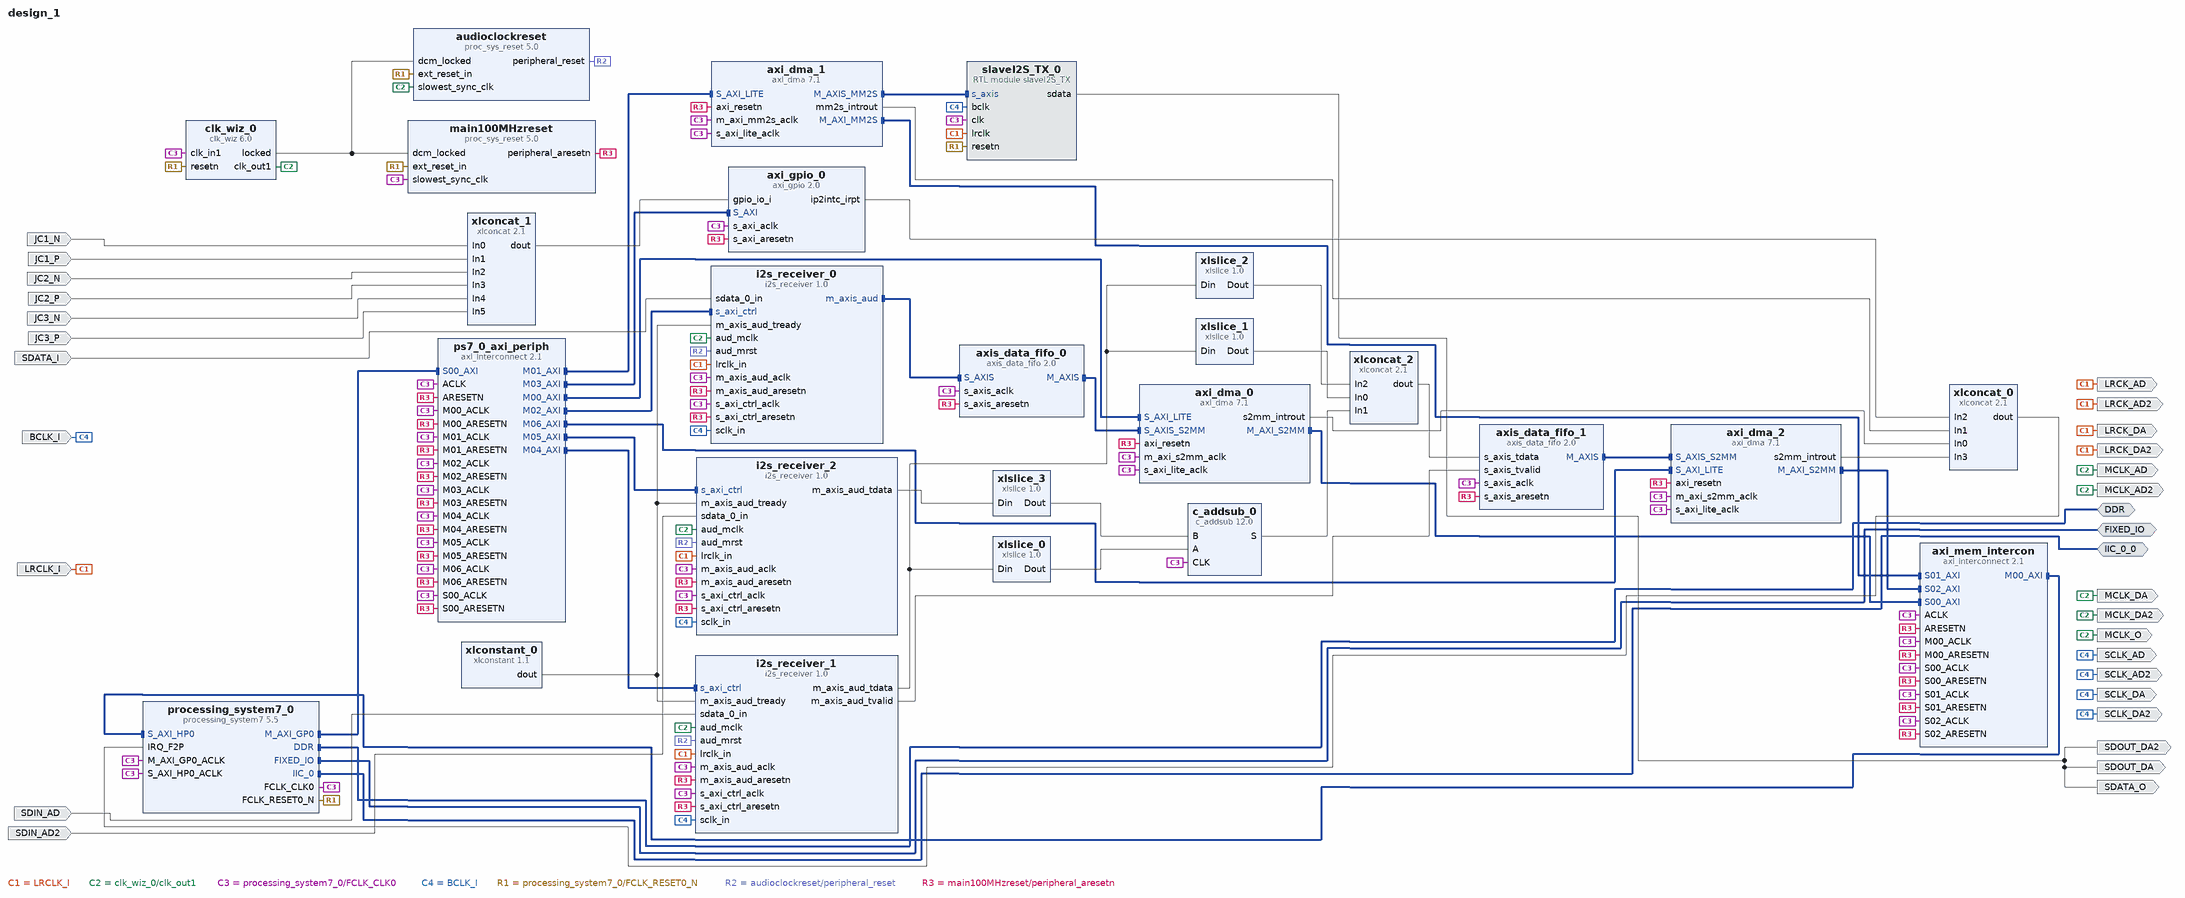
[diagram p0: block diagram of the top level]
# Vivado block design design_1, xc7z020clg484-1, Vivado 2020.1
create_bd_design design_1

create_bd_intf_port -mode Master -vlnv xilinx.com:interface:ddrx_rtl:1.0 DDR
create_bd_intf_port -mode Master -vlnv xilinx.com:display_processing_system7:fixedio_rtl:1.0 FIXED_IO
create_bd_intf_port -mode Master -vlnv xilinx.com:interface:iic_rtl:1.0 IIC_0_0
create_bd_port -dir O SDATA_O
create_bd_port -dir I SDATA_I
create_bd_port -dir I BCLK_I
create_bd_port -dir I LRCLK_I
create_bd_port -dir O MCLK_O
create_bd_port -dir I JC1_N
create_bd_port -dir I JC1_P
create_bd_port -dir I JC3_P
create_bd_port -dir I JC3_N
create_bd_port -dir I JC2_P
create_bd_port -dir I JC2_N
create_bd_port -dir O MCLK_DA
create_bd_port -dir O MCLK_AD
create_bd_port -dir O MCLK_DA2
create_bd_port -dir O MCLK_AD2
create_bd_port -dir O LRCK_DA
create_bd_port -dir O LRCK_DA2
create_bd_port -dir O SCLK_DA
create_bd_port -dir O SCLK_DA2
create_bd_port -dir I SDIN_AD
create_bd_port -dir I SDIN_AD2
create_bd_port -dir O SDOUT_DA
create_bd_port -dir O SDOUT_DA2
create_bd_port -dir O SCLK_AD
create_bd_port -dir O SCLK_AD2
create_bd_port -dir O LRCK_AD
create_bd_port -dir O LRCK_AD2

create_bd_cell -type ip -vlnv xilinx.com:ip:i2s_receiver:1.0 i2s_receiver_0
set_property -dict {CONFIG.C_32BIT_LR 1 CONFIG.C_DEPTH 1024 CONFIG.C_IS_MASTER 0} [get_bd_cells i2s_receiver_0]
create_bd_cell -type ip -vlnv xilinx.com:ip:processing_system7:5.5 processing_system7_0
set_property -dict [list \
  CONFIG.PCW_APU_PERIPHERAL_FREQMHZ 666.666667 \
  CONFIG.PCW_ENET0_ENET0_IO {MIO 16 .. 27} \
  CONFIG.PCW_ENET0_GRP_MDIO_ENABLE 1 \
  CONFIG.PCW_ENET0_GRP_MDIO_IO {MIO 52 .. 53} \
  CONFIG.PCW_ENET0_PERIPHERAL_ENABLE 1 \
  CONFIG.PCW_ENET0_RESET_ENABLE 0 \
  CONFIG.PCW_ENET_RESET_ENABLE 1 \
  CONFIG.PCW_ENET_RESET_SELECT {Share reset pin} \
  CONFIG.PCW_FPGA0_PERIPHERAL_FREQMHZ 100 \
  CONFIG.PCW_FPGA1_PERIPHERAL_FREQMHZ 150.000000 \
  CONFIG.PCW_GPIO_MIO_GPIO_ENABLE 1 \
  CONFIG.PCW_GPIO_MIO_GPIO_IO MIO \
  CONFIG.PCW_I2C0_I2C0_IO EMIO \
  CONFIG.PCW_I2C0_PERIPHERAL_ENABLE 1 \
  CONFIG.PCW_I2C_PERIPHERAL_FREQMHZ 111.111115 \
  CONFIG.PCW_I2C_RESET_ENABLE 1 \
  CONFIG.PCW_I2C_RESET_SELECT {Share reset pin} \
  CONFIG.PCW_IRQ_F2P_INTR 1 \
  CONFIG.PCW_PRESET_BANK1_VOLTAGE {LVCMOS 1.8V} \
  CONFIG.PCW_QSPI_GRP_SINGLE_SS_ENABLE 1 \
  CONFIG.PCW_QSPI_GRP_SINGLE_SS_IO {MIO 1 .. 6} \
  CONFIG.PCW_QSPI_PERIPHERAL_ENABLE 1 \
  CONFIG.PCW_QSPI_QSPI_IO {MIO 1 .. 6} \
  CONFIG.PCW_SD0_GRP_CD_ENABLE 1 \
  CONFIG.PCW_SD0_GRP_CD_IO {MIO 47} \
  CONFIG.PCW_SD0_GRP_WP_ENABLE 1 \
  CONFIG.PCW_SD0_GRP_WP_IO {MIO 46} \
  CONFIG.PCW_SD0_PERIPHERAL_ENABLE 1 \
  CONFIG.PCW_SD0_SD0_IO {MIO 40 .. 45} \
  CONFIG.PCW_SDIO_PERIPHERAL_FREQMHZ 50 \
  CONFIG.PCW_SINGLE_QSPI_DATA_MODE x4 \
  CONFIG.PCW_TTC0_PERIPHERAL_ENABLE 1 \
  CONFIG.PCW_TTC0_TTC0_IO EMIO \
  CONFIG.PCW_UART1_PERIPHERAL_ENABLE 1 \
  CONFIG.PCW_UART1_UART1_IO {MIO 48 .. 49} \
  CONFIG.PCW_UART_PERIPHERAL_FREQMHZ 50 \
  CONFIG.PCW_UIPARAM_DDR_FREQ_MHZ 533.333313 \
  CONFIG.PCW_UIPARAM_DDR_PARTNO {MT41J128M16 HA-15E} \
  CONFIG.PCW_USB0_PERIPHERAL_ENABLE 1 \
  CONFIG.PCW_USB0_RESET_ENABLE 0 \
  CONFIG.PCW_USB0_USB0_IO {MIO 28 .. 39} \
  CONFIG.PCW_USB_RESET_ENABLE 1 \
  CONFIG.PCW_USB_RESET_SELECT {Share reset pin} \
  CONFIG.PCW_USE_FABRIC_INTERRUPT 1 \
  CONFIG.PCW_USE_S_AXI_HP0 1 \
  CONFIG.preset ZedBoard \
] [get_bd_cells processing_system7_0]
# 225 more settings of processing_system7_0 are not shown: defaults, MIO pin electricals, DDR timing, and values the tool derives
create_bd_cell -type ip -vlnv xilinx.com:ip:clk_wiz:6.0 clk_wiz_0
set_property -dict [list \
  CONFIG.CLKOUT1_JITTER 360.948 \
  CONFIG.CLKOUT1_PHASE_ERROR 301.601 \
  CONFIG.CLKOUT1_REQUESTED_OUT_FREQ 12.288 \
  CONFIG.MMCM_CLKFBOUT_MULT_F 48.000 \
  CONFIG.MMCM_CLKOUT0_DIVIDE_F 78.125 \
  CONFIG.MMCM_DIVCLK_DIVIDE 5 \
  CONFIG.RESET_PORT resetn \
  CONFIG.RESET_TYPE ACTIVE_LOW \
  CONFIG.USE_RESET true \
] [get_bd_cells clk_wiz_0]
create_bd_cell -type ip -vlnv xilinx.com:ip:proc_sys_reset:5.0 main100MHzreset
create_bd_cell -type ip -vlnv xilinx.com:ip:proc_sys_reset:5.0 audioclockreset
create_bd_cell -type ip -vlnv xilinx.com:ip:axi_dma:7.1 axi_dma_0
set_property -dict [list \
  CONFIG.c_include_mm2s 0 \
  CONFIG.c_include_s2mm_dre 1 \
  CONFIG.c_include_sg 0 \
  CONFIG.c_s2mm_burst_size 32 \
  CONFIG.c_sg_length_width 26 \
] [get_bd_cells axi_dma_0]
create_bd_cell -type ip -vlnv xilinx.com:ip:axi_dma:7.1 axi_dma_1
set_property -dict [list \
  CONFIG.c_include_mm2s_dre 0 \
  CONFIG.c_include_s2mm 0 \
  CONFIG.c_include_sg 0 \
  CONFIG.c_mm2s_burst_size 32 \
  CONFIG.c_sg_length_width 26 \
] [get_bd_cells axi_dma_1]
create_bd_cell -type ip -vlnv xilinx.com:ip:axis_data_fifo:2.0 axis_data_fifo_0
set_property -dict {CONFIG.FIFO_DEPTH 8192 CONFIG.FIFO_MEMORY_TYPE block CONFIG.HAS_TLAST 1} [get_bd_cells axis_data_fifo_0]
create_bd_cell -type ip -vlnv xilinx.com:ip:axi_interconnect:2.1 ps7_0_axi_periph
set_property -dict {CONFIG.NUM_MI 7} [get_bd_cells ps7_0_axi_periph]
create_bd_cell -type ip -vlnv xilinx.com:ip:axi_interconnect:2.1 axi_mem_intercon
set_property -dict {CONFIG.NUM_MI 1 CONFIG.NUM_SI 3} [get_bd_cells axi_mem_intercon]
create_bd_cell -type ip -vlnv xilinx.com:ip:xlconcat:2.1 xlconcat_0
set_property -dict {CONFIG.NUM_PORTS 4} [get_bd_cells xlconcat_0]
create_bd_cell -type ip -vlnv xilinx.com:ip:xlconstant:1.1 xlconstant_0
create_bd_cell -type ip -vlnv xilinx.com:ip:xlconcat:2.1 xlconcat_1
set_property -dict {CONFIG.NUM_PORTS 6} [get_bd_cells xlconcat_1]
create_bd_cell -type ip -vlnv xilinx.com:ip:axi_gpio:2.0 axi_gpio_0
set_property -dict {CONFIG.C_ALL_INPUTS 1 CONFIG.C_GPIO_WIDTH 6 CONFIG.C_INTERRUPT_PRESENT 1} [get_bd_cells axi_gpio_0]
create_bd_cell -type ip -vlnv xilinx.com:ip:i2s_receiver:1.0 i2s_receiver_1
set_property -dict {CONFIG.C_32BIT_LR 1 CONFIG.C_DEPTH 1024 CONFIG.C_IS_MASTER 0} [get_bd_cells i2s_receiver_1]
create_bd_cell -type ip -vlnv xilinx.com:ip:i2s_receiver:1.0 i2s_receiver_2
set_property -dict {CONFIG.C_32BIT_LR 1 CONFIG.C_DEPTH 1024 CONFIG.C_IS_MASTER 0} [get_bd_cells i2s_receiver_2]
create_bd_cell -type ip -vlnv xilinx.com:ip:axis_data_fifo:2.0 axis_data_fifo_1
set_property -dict {CONFIG.FIFO_DEPTH 4096 CONFIG.TDATA_NUM_BYTES 4} [get_bd_cells axis_data_fifo_1]
create_bd_cell -type ip -vlnv xilinx.com:ip:c_addsub:12.0 c_addsub_0
set_property -dict [list \
  CONFIG.A_Width 23 \
  CONFIG.B_Value 00000000000000000000000 \
  CONFIG.B_Width 23 \
  CONFIG.CE false \
  CONFIG.C_In false \
  CONFIG.Implementation DSP48 \
  CONFIG.Latency 2 \
  CONFIG.Latency_Configuration Automatic \
  CONFIG.Out_Width 24 \
] [get_bd_cells c_addsub_0]
create_bd_cell -type ip -vlnv xilinx.com:ip:xlslice:1.0 xlslice_0
set_property -dict {CONFIG.DIN_FROM 27 CONFIG.DIN_TO 5 CONFIG.DOUT_WIDTH 23} [get_bd_cells xlslice_0]
create_bd_cell -type ip -vlnv xilinx.com:ip:xlslice:1.0 xlslice_1
set_property -dict {CONFIG.DIN_FROM 31 CONFIG.DIN_TO 28 CONFIG.DOUT_WIDTH 4} [get_bd_cells xlslice_1]
create_bd_cell -type ip -vlnv xilinx.com:ip:xlslice:1.0 xlslice_2
set_property -dict {CONFIG.DIN_FROM 3 CONFIG.DIN_TO 1 CONFIG.DOUT_WIDTH 3} [get_bd_cells xlslice_2]
create_bd_cell -type ip -vlnv xilinx.com:ip:xlslice:1.0 xlslice_3
set_property -dict {CONFIG.DIN_FROM 27 CONFIG.DIN_TO 5 CONFIG.DOUT_WIDTH 23} [get_bd_cells xlslice_3]
create_bd_cell -type ip -vlnv xilinx.com:ip:xlconcat:2.1 xlconcat_2
set_property -dict {CONFIG.IN0_WIDTH 4 CONFIG.IN1_WIDTH 24 CONFIG.IN2_WIDTH 4 CONFIG.NUM_PORTS 3} [get_bd_cells xlconcat_2]
create_bd_cell -type ip -vlnv xilinx.com:ip:axi_dma:7.1 axi_dma_2
set_property -dict [list \
  CONFIG.c_include_mm2s 0 \
  CONFIG.c_include_s2mm_dre 1 \
  CONFIG.c_include_sg 0 \
  CONFIG.c_sg_length_width 26 \
] [get_bd_cells axi_dma_2]
create_bd_cell -type module -reference slaveI2S_TX slaveI2S_TX_0

# ---- connections ----

connect_bd_intf_net [get_bd_intf_pins ps7_0_axi_periph/M02_AXI] [get_bd_intf_pins i2s_receiver_0/s_axi_ctrl]
connect_bd_intf_net [get_bd_intf_pins ps7_0_axi_periph/M05_AXI] [get_bd_intf_pins i2s_receiver_2/s_axi_ctrl]
connect_bd_intf_net [get_bd_intf_pins slaveI2S_TX_0/s_axis] [get_bd_intf_pins axi_dma_1/M_AXIS_MM2S]
connect_bd_intf_net [get_bd_intf_pins processing_system7_0/M_AXI_GP0] [get_bd_intf_pins ps7_0_axi_periph/S00_AXI]
connect_bd_intf_net [get_bd_intf_ports DDR] [get_bd_intf_pins processing_system7_0/DDR]
connect_bd_intf_net [get_bd_intf_pins axis_data_fifo_0/M_AXIS] [get_bd_intf_pins axi_dma_0/S_AXIS_S2MM]
connect_bd_intf_net [get_bd_intf_ports FIXED_IO] [get_bd_intf_pins processing_system7_0/FIXED_IO]
connect_bd_intf_net [get_bd_intf_pins axi_dma_1/M_AXI_MM2S] [get_bd_intf_pins axi_mem_intercon/S01_AXI]
connect_bd_intf_net [get_bd_intf_ports IIC_0_0] [get_bd_intf_pins processing_system7_0/IIC_0]
connect_bd_intf_net [get_bd_intf_pins ps7_0_axi_periph/M03_AXI] [get_bd_intf_pins axi_gpio_0/S_AXI]
connect_bd_intf_net [get_bd_intf_pins ps7_0_axi_periph/M04_AXI] [get_bd_intf_pins i2s_receiver_1/s_axi_ctrl]
connect_bd_intf_net [get_bd_intf_pins ps7_0_axi_periph/M01_AXI] [get_bd_intf_pins axi_dma_1/S_AXI_LITE]
connect_bd_intf_net [get_bd_intf_pins axi_dma_0/M_AXI_S2MM] [get_bd_intf_pins axi_mem_intercon/S00_AXI]
connect_bd_intf_net [get_bd_intf_pins axi_dma_2/M_AXI_S2MM] [get_bd_intf_pins axi_mem_intercon/S02_AXI]
connect_bd_intf_net [get_bd_intf_pins axi_mem_intercon/M00_AXI] [get_bd_intf_pins processing_system7_0/S_AXI_HP0]
connect_bd_intf_net [get_bd_intf_pins axis_data_fifo_1/M_AXIS] [get_bd_intf_pins axi_dma_2/S_AXIS_S2MM]
connect_bd_intf_net [get_bd_intf_pins ps7_0_axi_periph/M00_AXI] [get_bd_intf_pins axi_dma_0/S_AXI_LITE]
connect_bd_intf_net [get_bd_intf_pins ps7_0_axi_periph/M06_AXI] [get_bd_intf_pins axi_dma_2/S_AXI_LITE]
connect_bd_intf_net [get_bd_intf_pins i2s_receiver_0/m_axis_aud] [get_bd_intf_pins axis_data_fifo_0/S_AXIS]
connect_bd_net [get_bd_ports LRCLK_I] \
  [get_bd_pins i2s_receiver_0/lrclk_in] [get_bd_ports LRCK_DA2] [get_bd_ports LRCK_DA] [get_bd_ports LRCK_AD2] \
  [get_bd_ports LRCK_AD] [get_bd_pins i2s_receiver_2/lrclk_in] [get_bd_pins i2s_receiver_1/lrclk_in] \
  [get_bd_pins slaveI2S_TX_0/lrclk]
connect_bd_net [get_bd_pins clk_wiz_0/clk_out1] \
  [get_bd_ports MCLK_O] [get_bd_pins i2s_receiver_0/aud_mclk] [get_bd_pins audioclockreset/slowest_sync_clk] \
  [get_bd_pins i2s_receiver_2/aud_mclk] [get_bd_pins i2s_receiver_1/aud_mclk] [get_bd_ports MCLK_DA] [get_bd_ports MCLK_AD] \
  [get_bd_ports MCLK_DA2] [get_bd_ports MCLK_AD2]
connect_bd_net [get_bd_pins processing_system7_0/FCLK_CLK0] \
  [get_bd_pins clk_wiz_0/clk_in1] [get_bd_pins i2s_receiver_0/m_axis_aud_aclk] [get_bd_pins i2s_receiver_0/s_axi_ctrl_aclk] \
  [get_bd_pins processing_system7_0/M_AXI_GP0_ACLK] [get_bd_pins main100MHzreset/slowest_sync_clk] \
  [get_bd_pins axi_dma_0/s_axi_lite_aclk] [get_bd_pins axi_dma_1/s_axi_lite_aclk] [get_bd_pins axis_data_fifo_0/s_axis_aclk] \
  [get_bd_pins axi_dma_0/m_axi_s2mm_aclk] [get_bd_pins axi_dma_1/m_axi_mm2s_aclk] \
  [get_bd_pins processing_system7_0/S_AXI_HP0_ACLK] [get_bd_pins ps7_0_axi_periph/ACLK] \
  [get_bd_pins ps7_0_axi_periph/S00_ACLK] [get_bd_pins ps7_0_axi_periph/M00_ACLK] [get_bd_pins ps7_0_axi_periph/M01_ACLK] \
  [get_bd_pins axi_mem_intercon/ACLK] [get_bd_pins axi_mem_intercon/S00_ACLK] [get_bd_pins axi_mem_intercon/M00_ACLK] \
  [get_bd_pins axi_mem_intercon/S01_ACLK] [get_bd_pins ps7_0_axi_periph/M02_ACLK] [get_bd_pins ps7_0_axi_periph/M03_ACLK] \
  [get_bd_pins axi_gpio_0/s_axi_aclk] [get_bd_pins i2s_receiver_1/s_axi_ctrl_aclk] [get_bd_pins ps7_0_axi_periph/M04_ACLK] \
  [get_bd_pins i2s_receiver_2/s_axi_ctrl_aclk] [get_bd_pins ps7_0_axi_periph/M05_ACLK] \
  [get_bd_pins i2s_receiver_1/m_axis_aud_aclk] [get_bd_pins i2s_receiver_2/m_axis_aud_aclk] \
  [get_bd_pins axis_data_fifo_1/s_axis_aclk] [get_bd_pins c_addsub_0/CLK] [get_bd_pins axi_dma_2/s_axi_lite_aclk] \
  [get_bd_pins axi_dma_2/m_axi_s2mm_aclk] [get_bd_pins axi_mem_intercon/S02_ACLK] [get_bd_pins ps7_0_axi_periph/M06_ACLK] \
  [get_bd_pins slaveI2S_TX_0/clk]
connect_bd_net [get_bd_ports SDATA_I] [get_bd_pins i2s_receiver_0/sdata_0_in]
connect_bd_net [get_bd_ports BCLK_I] \
  [get_bd_pins i2s_receiver_0/sclk_in] [get_bd_ports SCLK_AD2] [get_bd_ports SCLK_AD] [get_bd_ports SCLK_DA2] \
  [get_bd_ports SCLK_DA] [get_bd_pins i2s_receiver_2/sclk_in] [get_bd_pins i2s_receiver_1/sclk_in] \
  [get_bd_pins slaveI2S_TX_0/bclk]
connect_bd_net [get_bd_pins processing_system7_0/FCLK_RESET0_N] \
  [get_bd_pins main100MHzreset/ext_reset_in] [get_bd_pins audioclockreset/ext_reset_in] [get_bd_pins clk_wiz_0/resetn] \
  [get_bd_pins slaveI2S_TX_0/resetn]
connect_bd_net [get_bd_pins clk_wiz_0/locked] [get_bd_pins main100MHzreset/dcm_locked] [get_bd_pins audioclockreset/dcm_locked]
connect_bd_net [get_bd_pins audioclockreset/peripheral_reset] \
  [get_bd_pins i2s_receiver_0/aud_mrst] [get_bd_pins i2s_receiver_1/aud_mrst] [get_bd_pins i2s_receiver_2/aud_mrst]
connect_bd_net [get_bd_pins main100MHzreset/peripheral_aresetn] \
  [get_bd_pins i2s_receiver_0/m_axis_aud_aresetn] [get_bd_pins i2s_receiver_0/s_axi_ctrl_aresetn] \
  [get_bd_pins axi_dma_0/axi_resetn] [get_bd_pins axi_dma_1/axi_resetn] [get_bd_pins axis_data_fifo_0/s_axis_aresetn] \
  [get_bd_pins ps7_0_axi_periph/S00_ARESETN] [get_bd_pins ps7_0_axi_periph/M00_ARESETN] \
  [get_bd_pins ps7_0_axi_periph/ARESETN] [get_bd_pins ps7_0_axi_periph/M01_ARESETN] \
  [get_bd_pins axi_mem_intercon/S00_ARESETN] [get_bd_pins axi_mem_intercon/M00_ARESETN] \
  [get_bd_pins axi_mem_intercon/ARESETN] [get_bd_pins axi_mem_intercon/S01_ARESETN] \
  [get_bd_pins ps7_0_axi_periph/M02_ARESETN] [get_bd_pins ps7_0_axi_periph/M03_ARESETN] \
  [get_bd_pins axi_gpio_0/s_axi_aresetn] [get_bd_pins i2s_receiver_1/s_axi_ctrl_aresetn] \
  [get_bd_pins ps7_0_axi_periph/M04_ARESETN] [get_bd_pins i2s_receiver_2/s_axi_ctrl_aresetn] \
  [get_bd_pins ps7_0_axi_periph/M05_ARESETN] [get_bd_pins i2s_receiver_1/m_axis_aud_aresetn] \
  [get_bd_pins i2s_receiver_2/m_axis_aud_aresetn] [get_bd_pins axis_data_fifo_1/s_axis_aresetn] \
  [get_bd_pins axi_dma_2/axi_resetn] [get_bd_pins axi_mem_intercon/S02_ARESETN] [get_bd_pins ps7_0_axi_periph/M06_ARESETN]
connect_bd_net [get_bd_pins axi_dma_0/s2mm_introut] [get_bd_pins xlconcat_0/In0]
connect_bd_net [get_bd_pins axi_dma_1/mm2s_introut] [get_bd_pins xlconcat_0/In1]
connect_bd_net [get_bd_pins xlconcat_0/dout] [get_bd_pins processing_system7_0/IRQ_F2P]
connect_bd_net [get_bd_pins xlconstant_0/dout] \
  [get_bd_pins i2s_receiver_0/m_axis_aud_tready] [get_bd_pins i2s_receiver_2/m_axis_aud_tready] \
  [get_bd_pins i2s_receiver_1/m_axis_aud_tready]
connect_bd_net [get_bd_pins slaveI2S_TX_0/sdata] [get_bd_ports SDATA_O] [get_bd_ports SDOUT_DA] [get_bd_ports SDOUT_DA2]
connect_bd_net [get_bd_ports JC1_N] [get_bd_pins xlconcat_1/In0]
connect_bd_net [get_bd_ports JC1_P] [get_bd_pins xlconcat_1/In1]
connect_bd_net [get_bd_ports JC2_N] [get_bd_pins xlconcat_1/In2]
connect_bd_net [get_bd_ports JC2_P] [get_bd_pins xlconcat_1/In3]
connect_bd_net [get_bd_ports JC3_N] [get_bd_pins xlconcat_1/In4]
connect_bd_net [get_bd_ports JC3_P] [get_bd_pins xlconcat_1/In5]
connect_bd_net [get_bd_pins xlconcat_1/dout] [get_bd_pins axi_gpio_0/gpio_io_i]
connect_bd_net [get_bd_ports SDIN_AD] [get_bd_pins i2s_receiver_1/sdata_0_in]
connect_bd_net -net SDIN_AD2_1 [get_bd_ports SDIN_AD2] [get_bd_pins i2s_receiver_2/sdata_0_in]
connect_bd_net [get_bd_pins axi_gpio_0/ip2intc_irpt] [get_bd_pins xlconcat_0/In2]
connect_bd_net [get_bd_pins i2s_receiver_1/m_axis_aud_tdata] [get_bd_pins xlslice_0/Din] [get_bd_pins xlslice_1/Din] [get_bd_pins xlslice_2/Din]
connect_bd_net [get_bd_pins xlslice_0/Dout] [get_bd_pins c_addsub_0/A]
connect_bd_net [get_bd_pins i2s_receiver_2/m_axis_aud_tdata] [get_bd_pins xlslice_3/Din]
connect_bd_net [get_bd_pins xlslice_3/Dout] [get_bd_pins c_addsub_0/B]
connect_bd_net [get_bd_pins c_addsub_0/S] [get_bd_pins xlconcat_2/In1]
connect_bd_net [get_bd_pins xlslice_1/Dout] [get_bd_pins xlconcat_2/In0]
connect_bd_net [get_bd_pins xlslice_2/Dout] [get_bd_pins xlconcat_2/In2]
connect_bd_net [get_bd_pins xlconcat_2/dout] [get_bd_pins axis_data_fifo_1/s_axis_tdata]
connect_bd_net [get_bd_pins i2s_receiver_1/m_axis_aud_tvalid] [get_bd_pins axis_data_fifo_1/s_axis_tvalid]
connect_bd_net [get_bd_pins axi_dma_2/s2mm_introut] [get_bd_pins xlconcat_0/In3]

# ---- address map ----
assign_bd_address -offset 0x00000000 -range 512M -target_address_space [get_bd_addr_spaces axi_dma_0/Data_S2MM] [get_bd_addr_segs processing_system7_0/S_AXI_HP0/HP0_DDR_LOWOCM]
assign_bd_address -offset 0x00000000 -range 512M -target_address_space [get_bd_addr_spaces axi_dma_1/Data_MM2S] [get_bd_addr_segs processing_system7_0/S_AXI_HP0/HP0_DDR_LOWOCM]
assign_bd_address -offset 0x00000000 -range 512M -target_address_space [get_bd_addr_spaces axi_dma_2/Data_S2MM] [get_bd_addr_segs processing_system7_0/S_AXI_HP0/HP0_DDR_LOWOCM]
assign_bd_address -offset 0x40400000 -range 64K -target_address_space [get_bd_addr_spaces processing_system7_0/Data] [get_bd_addr_segs axi_dma_0/S_AXI_LITE/Reg]
assign_bd_address -offset 0x40410000 -range 64K -target_address_space [get_bd_addr_spaces processing_system7_0/Data] [get_bd_addr_segs axi_dma_1/S_AXI_LITE/Reg]
assign_bd_address -offset 0x40420000 -range 64K -target_address_space [get_bd_addr_spaces processing_system7_0/Data] [get_bd_addr_segs axi_dma_2/S_AXI_LITE/Reg]
assign_bd_address -offset 0x41200000 -range 64K -target_address_space [get_bd_addr_spaces processing_system7_0/Data] [get_bd_addr_segs axi_gpio_0/S_AXI/Reg]
assign_bd_address -offset 0x43C00000 -range 64K -target_address_space [get_bd_addr_spaces processing_system7_0/Data] [get_bd_addr_segs i2s_receiver_0/s_axi_ctrl/Reg]
assign_bd_address -offset 0x43C10000 -range 64K -target_address_space [get_bd_addr_spaces processing_system7_0/Data] [get_bd_addr_segs i2s_receiver_1/s_axi_ctrl/Reg]
assign_bd_address -offset 0x43C20000 -range 64K -target_address_space [get_bd_addr_spaces processing_system7_0/Data] [get_bd_addr_segs i2s_receiver_2/s_axi_ctrl/Reg]
exclude_bd_addr_seg -offset 0x00000000 -range 1 -target_address_space [get_bd_addr_spaces processing_system7_0/Data] [get_bd_addr_segs processing_system7_0/S_AXI_HP0/HP0_DDR_LOWOCM]

validate_bd_design
save_bd_design
